# Altium schematic sheet USB.SchDoc: Stabilizer
size 420 x 297 mm; Author: G.Kasprowicz; CompanyName: WUT ISE; DrawnBy: G.Kasprowicz; Organization: WUT ISE; Address1: PW ISE; Address2: Nowowiejska 15/19 00-665 Warsaw; Address3: gkasprow@gmail.com; DocumentNumber: 5; Revision: 3.4; SheetNumber: 5; SheetTotal: 11; ModifiedBy: -; CheckedDate: -; Title2: USB connector; DivGrp: WUT ISE; Designer: G.Kasprowicz; ModifiedDate: -; ProjectName: Sensor Box
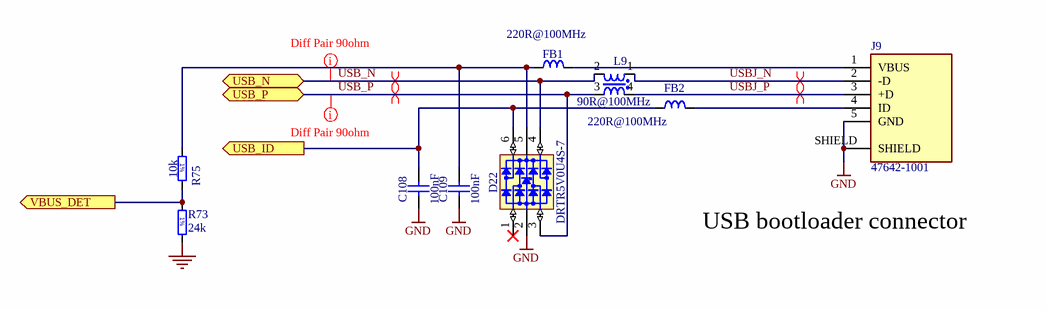
[diagram p0: USB.SchDoc]

## Parts
C108  100nF  [CAPC1005X55N]
C109  100nF  [CAPC1005X55N]
D22  DRTR5V0U4S-7  [SOT65P210X110-6N]
FB1  220R@100MHz  [INDC2012X105N]
FB2  220R@100MHz  [INDC2012X105N]
J9  47642-1001  [476421001]
L9  90R@100MHz  [IND_MURATA_DLW21S]
R73  24k  [RESC1608X55N]
R75  10k  [RESC1005X40N]

## Ports
USB_ID (out), USB_N (bidir), USB_P (bidir), VBUS_DET (out)

## Nets
GND: C108.1 C109.1 D22.2(GND) J9.5(GND) J9.SHIELD R73.2
USB_ID: C108.2 D22.6(I/O4) FB2.1 ; port USB_ID
USB_N: D22.4(I/O3) L9.2 ; port USB_N
USB_P: D22.3(I/O2) L9.3 ; port USB_P
USBJ_N: J9.2(-D) L9.1
USBJ_P: J9.3(+D) L9.4
VBUS_DET: R73.1 R75.2 ; port VBUS_DET
NetC109_2: C109.2 D22.5(VBUS) FB1.1 R75.1
NetFB1_2: FB1.2 J9.1(VBUS)
NetFB2_2: FB2.2 J9.4(ID)

Not connected (* = marked no-connect by the designer): D22 1(I/O1)*

## Layout directives
mark named Diff Pair 90ohm: USB_N, USB_P
differential pair: USB_N, USB_P, USBJ_N, USBJ_P

## Notes on the sheet
- USB bootloader connector
- Project/Equipment
- Document
- Designer
- Drawn by
- Check.by
- Copyright WUT ISE 2018.
  This documentation describes Open Hardware and is licensed under the CERN OHL v.1.1. You may redistribute and modify this documentation under the terms of the CERN OHL v.1.1. (http://ohwr.org/CERNOHL). This documentation is distributed WITHOUT ANY EXPRESS OR IMPLIED WARRANTY, INCLUDING OF MERCHANTABILITY, SATISFACTORY QUALITY AND FITNESS FOR A PARTICULAR PURPOSE. Please see the CERN OHL v.1.1 for applicable conditions.
- Contact
- File
- Last Mod.
- Print Date
- Sheet
- Size
- A3
- of
- Rev
- (in symbol R0402_10K_1%_0.0625W_100PPM) 1%
- (in symbol R0603_24K_1%_0.1W_100PPM) 1%

## Library data of the parts
C108 C109 = CC0402_100NF_16V_10%_X7R: Non-polarised capacitor; Part Description: SMD Multilayer Chip Ceramic Capacitor; Manufacturer: GENERIC; Manufacturer1 Part Number: GRM155R71C104KA88D; Voltage: 16V; TC: X7R; Tolerance: ±10%; Part Number: CC0402_100NF_16V_10%_X7R; Component Kind: Standard; Component Type: Standard; Pin Count: 2; Value: 100nF; Status: Not Recommended; Manufacturer Part Number: CC0402_100NF_16V_10%_X7R; Case: 0402; Mounted: Yes; Socket: No; SMD: Yes; Manufacturer1 Example: MURATA; Manufacturer1 ComponentHeight: 0.55mm; HelpURL: \\cern.ch\dfs\Applications\Altium\Datasheets\CC0402_X7R_MURATA_GRM.pdf; Author: CERN DEM JLC; CreateDate: 05.12.2013; LatestRevisionDate: 03.12.2007; Sense: No
D22 = D_TVS_DRTR5V0U4S-7: Integrated Quad Ultra-Low Capacitance ESD Protection; Part Description: Integrated Quad Ultra-Low Capacitance ESD (±8kV) Protection; Manufacturer: DIODES; PressFit: No; Bonding: No; Status Comment: Active; Part Number: DRTR5V0U4S-7; Component Kind: Standard; Component Type: Standard; Device: DRTR5V0U4S-7; PackageDescription: SOT363, SC70-6, 0.65mm Pitch; 6 Pin, 1.25mm W X 2.00mm L X 1.10mm H body, IPC Medium Density; Status: Active; Manufacturer Part Number: DRTR5V0U4S-7; Pin Count: 6; Case: SOT363; Mounted: Yes; Socket: No; SMD: Yes; Sense: No; ComponentHeight: 1.1mm; HelpURL: \\cern.ch\dfs\Applications\Altium\Datasheets\PRTR5V0U4Y.pdf; Author: GK; CreateDate: 24.01.2017; LatestRevisionDate: 14.09.2020
FB1 FB2 = IND0805_MURATA_BLM21PG221SN1D: Inductor; Part Description: SMD EMIFIL Suppression Chip Ferrite Bead; Manufacturer: MURATA; Power: 2A; Resistance: 0.05R; Tolerance: ±25%; Table: Inductors SMD; Part Number: IND0805_MURATA_BLM21PG221SN1D; Component Kind: Standard; Component Type: Standard; Pin Count: 2; Value: 220R@100MHz; Status: None; Manufacturer Part Number: BLM21PG221SN1D; Case: 0805; Mounted: Yes; Socket: No; SMD: Yes; ComponentHeight: 1.05mm; HelpURL: \\cern.ch\dfs\Applications\Altium\Datasheets\IND0402_MURATA_BLM21P.pdf; Author: CERN DEM JLC; CreateDate: 2010-01-25; LatestRevisionDate: 2010-01-25
J9 = 47642-1001: Connector; Manufacturer_Name: Molex; Datasheet Link: https://www.molex.com/pdm_docs/sd/476421001_sd.pdf; Height: 2.94mm; Manufacturer Part Number: 47642-1001; Mouser Part Number: 538-47642-1001; Mouser Price/Stock: https://www.mouser.co.uk/ProductDetail/Molex/47642-1001?qs=yd8XiKYcH9m5swOqK5ZC9Q%3D%3D
L9 = IND_MURATA_DLW21SN900SQ2L: Inductor Common Mode; Part Description: Wire Wound Common Mode Choke Coil (DLW21S Series); Manufacturer: MURATA; Power: 330mA; Resistance: 0.35R; Tolerance: ±25%; Part Number: IND_MURATA_DLW21SN900SQ2L; Component Kind: Standard; Component Type: Standard; Pin Count: 4; Value: 90R@100MHz; Status: None; Manufacturer Part Number: DLW21SN900SQ2L; Case: 0805; Mounted: Yes; Socket: No; SMD: Yes; Sense: No; ComponentHeight: 1.4mm; HelpURL: \\cern.ch\dfs\Applications\Altium\Datasheets\IND_MURATA_DLW21S.pdf; Author: CERN DEM JLC; CreateDate: 01.07.2014; LatestRevisionDate: 01.07.2014
R73 = R0603_24K_1%_0.1W_100PPM: Resistor - 1%; Part Description: General Purpose Thick Film Chip Resistor; Manufacturer: GENERIC; Manufacturer1 Part Number: NRC06F2402TRF; Power: 0.1W; TC: ±100ppm/°C; Part Number: R0603_24K_1%_0.1W_100PPM; Component Kind: Standard; Component Type: Standard; Pin Count: 2; Value: 24k; Status: Preferred; Tolerance: ±1%; Manufacturer Part Number: R0603_24K_1%_0.1W_100PPM; Case: 0603; Mounted: Yes; Sense: No; Socket: No; SMD: Yes; Manufacturer1 Example: NIC COMPONENT; Manufacturer1 ComponentHeight: 0.55mm; HelpURL: \\cern.ch\dfs\Applications\Altium\Datasheets\R0603_NIC_NRC.pdf; Author: CERN DEM JLC; CreateDate: 03.12.2007; LatestRevisionDate: 13.03.2008
R75 = R0402_10K_1%_0.0625W_100PPM: Resistor - 1%; Part Description: General Purpose Thick Film Chip Resistor; Manufacturer: GENERIC; Manufacturer1 Part Number: 232270671003L; TC: ±100ppm/°C; PressFit: No; Part Number: R0402_10K_1%_0.0625W_100PPM; Component Kind: Standard; Component Type: Standard; Pin Count: 2; Value: 10k; Status: Not Recommended; Power: 0.0625W; Tolerance: ±1%; Manufacturer Part Number: R0402_10K_1%_0.0625W_100PPM; Case: 0402; Mounted: Yes; Sense: No; Socket: No; SMD: Yes; Manufacturer1 Example: YAGEO PHYCOMP; Manufacturer1 ComponentHeight: 0.4mm; HelpURL: \\cern.ch\dfs\Applications\Altium\Datasheets\R0402_Phycomp_RC0402.pdf; Author: CERN DEM JLC; CreateDate: 03.12.2007; LatestRevisionDate: 17.10.2012